# EAGLE design interstage_A2v2 (EAGLE 9.1.0)
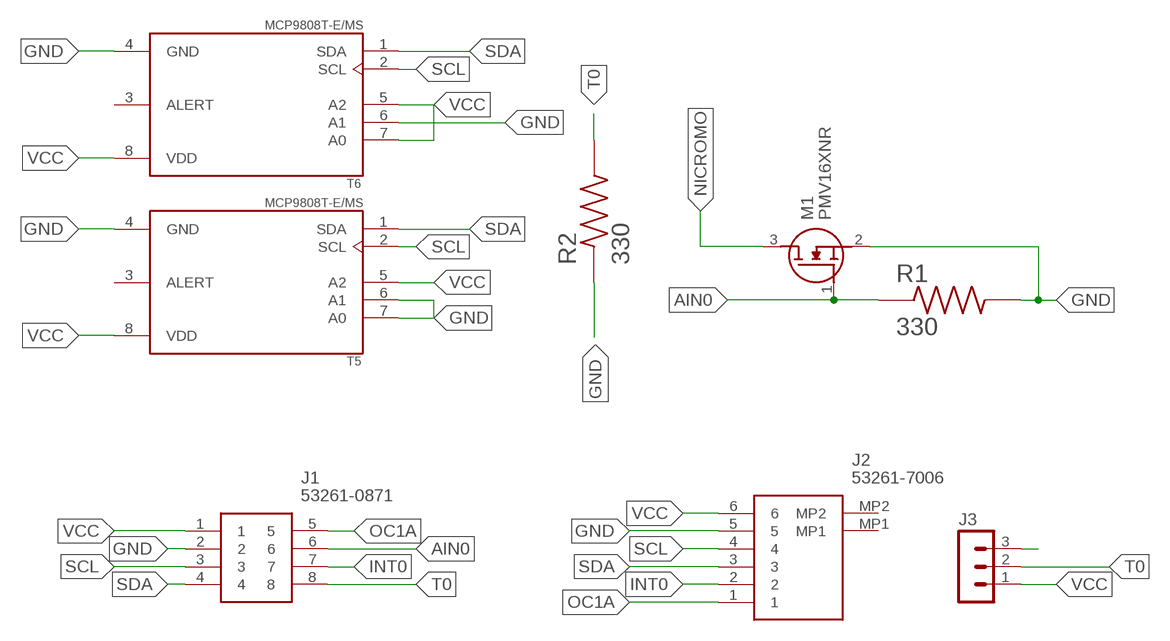
[diagram p0: schematic, sheet 1]

## Parts
J1  53261-0871  [53261-0871]
J2  53261-7006  [532617006]
J3  MA03-1  [MA03-1]
M1  PMV16XNR  [SOT95P230X110-3N]
R1  330  ERA-8AEB331V  [RESC3216X70N]
R2  330  ERA-8AEB331V  [RESC3216X70N]
T5  MCP9808T-E/MS  [SOP65P490X110-8N]
T6  MCP9808T-E/MS  [SOP65P490X110-8N]

## Nets
AIN0: J1.6 M1.1(G) R1.1
GND: J1.2 J2.5 M1.2(S) R1.2 R2.1 T5.4(GND) T5.6(A1) T5.7(A0) T6.4(GND) T6.6(A1)
INT0: J1.7 J2.2
N$7: J3.3
NICROMO: M1.3(D)
OC1A: J1.5 J2.1
SCL: J1.3 J2.4 T5.2(SCL) T6.2(SCL)
SDA: J1.4 J2.3 T5.1(SDA) T6.1(SDA)
T0: J1.8 J3.2 R2.2
VCC: J1.1 J2.6 J3.1 T5.5(A2) T5.8(VDD) T6.5(A2) T6.7(A0) T6.8(VDD)
Unconnected: J2.MP1 J2.MP2 T5.3(ALERT) T6.3(ALERT)

## Library data of the parts
J1 = SamacSys_Parts:53261-0871: Molex PICOBLADE Series, Series Number 53261, 1.25mm Pitch, 8 Way 1 Row Shrouded Right Angle PCB Header, Surface Mount Source: Datasheet <http://www.molex.com/webdocs/datasheets/pdf/en-us/0532610871_PCB_HEADERS.pdf>; DESCRIPTION: Molex PICOBLADE Series, Series Number 53261, 1.25mm Pitch, 8 Way 1 Row Shrouded Right Angle PCB Header, Surface Mount; HEIGHT: mm; MANUFACTURER_NAME: Molex; MANUFACTURER_PART_NUMBER: 53261-0871; MOUSER_PART_NUMBER: 538-53261-0871; MOUSER_PRICE-STOCK: https://www.mouser.co.uk/ProductDetail/Molex/53261-0871?qs=%252B72YyncTwW%252BggfdCJ7Netw%3D%3D
J2 = SamacSys_Parts:53261-7006: 1.25mm Pitch, PicoBlade PCB Header, Single Row, Right-Angle, Surface Mount, Gold (Au) Plating, Friction Lock, Circuits, Tape and Reel Source: Datasheet <https://componentsearchengine.com/Datasheets/1/53261-7006.pdf>; DESCRIPTION: 1.25mm Pitch, PicoBlade PCB Header, Single Row, Right-Angle, Surface Mount, Gold (Au) Plating, Friction Lock, Circuits, Tape and Reel; HEIGHT: 3.6mm; MANUFACTURER_NAME: Molex; MANUFACTURER_PART_NUMBER: 53261-7006; MOUSER_PART_NUMBER: 538-53261-7006; MOUSER_PRICE-STOCK: https://www.mouser.co.uk/ProductDetail/Molex/53261-7006?qs=0lSvoLzn4L%2FSBef0BTU2GA%3D%3D
J3 = con-lstb:MA03-1: PIN HEADER; OC_FARNELL: unknown; OC_NEWARK: unknown
M1 = SamacSys_Parts:PMV16XNR: Nexperia PMV16XNR N-channel MOSFET, 8.6 A, 20 V PMV16XN, 3-Pin SOT-23 Source: Datasheet <https://componentsearchengine.com/Datasheets/1/PMV16XNR.pdf>; DESCRIPTION: Nexperia PMV16XNR N-channel MOSFET, 8.6 A, 20 V PMV16XN, 3-Pin SOT-23; HEIGHT: 1.1mm; MANUFACTURER_NAME: Nexperia; MANUFACTURER_PART_NUMBER: PMV16XNR; MOUSER_PART_NUMBER: 771-PMV16XNR; MOUSER_PRICE-STOCK: https://www.mouser.com/Search/Refine.aspx?Keyword=771-PMV16XNR
R1 R2 = resistor_330_smd:ERA-8AEB331V; DESCRIPTION: 330 Ohms ±0.1% 0.25W, 1/4W Chip Resistor 1206 (3216 Metric) Automotive AEC-Q200 Thin Film; DIGI-KEY_PART_NUMBER: P330BCCT-ND; MF: Panasonic Electronic; MP: ERA-8AEB331V; PACKAGE: 3216 Panasonic Electronic Components
T5 T6 = sensorSPEL:MCP9808T-E/MS: Board Mount Temperature Sensors Silicon temp sensor with I2C interface; DESCRIPTION: Temperature Sensor Digital, Local -40°C ~ 125°C 10 b 8-MSOP; DIGI-KEY_PART_NUMBER: MCP9808T-E/MSCT-ND; MF: Microchip; MP: MCP9808T-E/MS; PACKAGE: MSOP-8 Microchip

## Board
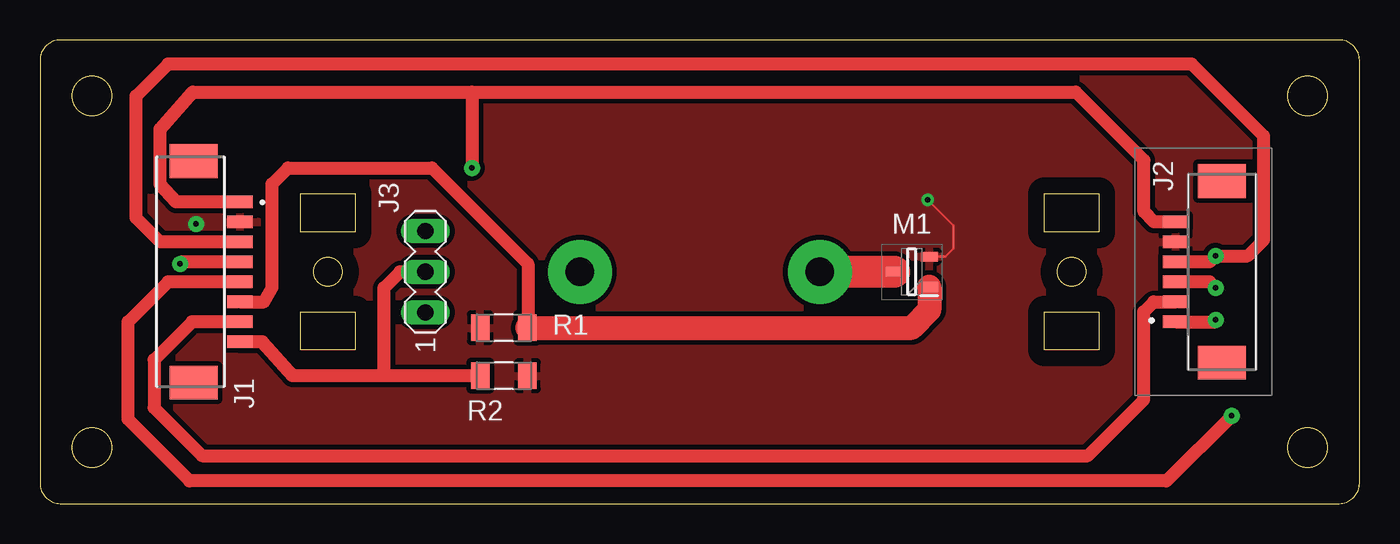
[diagram p1: board, top side]
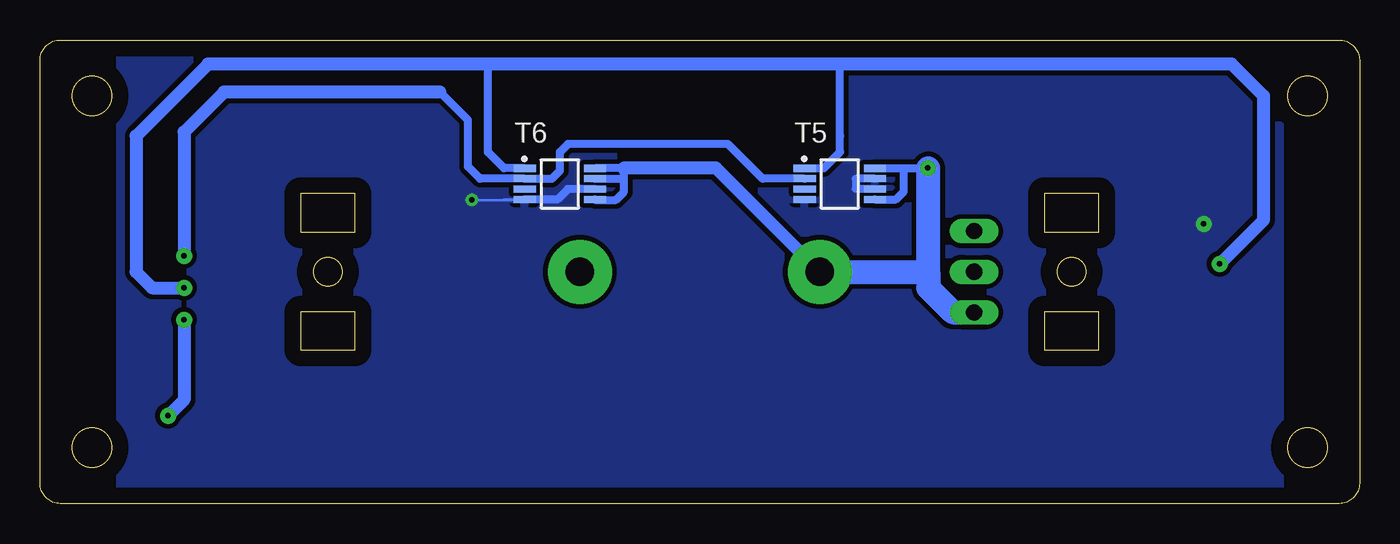
[diagram p2: board, bottom side, seen from below]

Size 82.5 x 29 mm. Coordinates in mm from the lower left corner, seen from the top.
Outline: 16.3,17 16.3,19.4 19.7,19.4 19.7,17 16.3,17
Outline: 62.8,9.6 62.8,12 66.2,12 66.2,9.6 62.8,9.6
Outline: 16.3,9.6 16.3,12 19.7,12 19.7,9.6 16.3,9.6
Outline: 62.8,17 62.8,19.4 66.2,19.4 66.2,17 62.8,17
Outline: 82.5,1.27 82.5,27.73 arc90 81.23,29 1.27,29 arc90 0,27.73 0,1.27 arc90 1.27,0 81.23,0 arc90 82.5,1.27
Outline: circle at 18,14.5 radius 0.9
Outline: circle at 64.5,14.5 radius 0.9
Outline: circle at 3.25,25.5 radius 1.25
Outline: circle at 79.25,3.5 radius 1.25
Outline: circle at 79.25,25.5 radius 1.25
Outline: circle at 3.25,3.5 radius 1.25
Copper layers (1*16): Top 0.035mm / dielectric 1.5mm / Bottom 0.035mm
Design rules "default *": minimum track width 6mil, minimum drill 0.35mm, track to track 0.3mm, track to pad 6mil, pad to pad 6mil, via to via 6mil, smd to smd 6mil, copper to edge 40mil, drill to drill 6mil, minimum pad ring 10mil, minimum via ring 8mil, stop-mask expansion 4mil, vias tented up to drill 0mil, thermal gap 10mil

### Footprints (pad centres in the part's own frame; a part is rotated, then mirrored left to right if it is on the bottom)
53261-0871 = smd 0.8 x 1.6: 1 -4.375,1.004; 2 -3.125,1.004; 3 -1.875,1.004; 4 -0.625,1.004; 5 0.625,1.004; 6 1.875,1.004; 7 3.125,1.004; 8 4.375,1.004 | smd 2.1 x 3: 9 6.925,-1.896; 10 -6.925,-1.896
532617006 = smd 0.8 x 1.6: 1 3.125,-2.5; 2 1.875,-2.5; 3 0.625,-2.5; 4 -0.625,-2.5; 5 -1.875,-2.5; 6 -3.125,-2.5 | smd 2.1 x 3: MP1 5.675,0.4; MP2 -5.675,0.4
MA03-1 = drill 1.016 long: 1 -2.54,0; 2 0,0; 3 2.54,0
SOT95P230X110-3N = smd 1.05 x 0.6: 1 -1.1,0.95; 2 -1.1,-0.95; 3 1.1,0
RESC3216X70N = smd 1.16 x 1.68: 1 -1.475,0; 2 1.475,0
SOP65P490X110-8N = smd 1.4 x 0.45: 1 -2.2,0.975; 2 -2.2,0.325; 3 -2.2,-0.325; 4 -2.2,-0.975; 5 2.2,-0.975; 6 2.2,-0.325; 7 2.2,0.325; 8 2.2,0.975

### Placement (x,y rotation side)
J1  11.5,14.5 270 top
J2  73.5,14.5 270 top
J3  24.1,14.5 90 top
M1  54.5,14.5 180 top
R1  29,11 180 top
R2  29,8 180 top
T5  32.5,20 0 bottom
T6  50,20 0 bottom

### Tracks (layer width: path | path; a pad name or v marks a point on that pad's centre or on a via)
AIN0
  Top 0.5: 30.5,11.03 R1.1
  Top 0.8: J1.6 14,12.62 14.5,13.5 14.5,20 15.5,21 24.5,21 30.5,15 30.5,11.03
  Top 1.5: R1.1 54.5,11 55.6,12.1 M1.1
GND  (via drill 0.35, 0.35 pad 1)
  Top 0.152: v55.5,19 57.1,17.4 57.1,15.95 56.6,15.45 M1.2
  Bottom 0.152: 53.5,19 53.48,19.02 T6.4 52.23,19 v55.5,19
  Bottom 0.5: T5.6 31.5,19.68 31.5,20.32 T5.7 | T6.6 49.5,19.68 50.15,19.02 T6.4
  other vias: 9.75,17.5
  pour Top (isolate 0.25): 5,28.3 5,0.5 77.5,0.5 77.5,28.3
  pour Bottom (isolate 0.25): 5,28.2 5,0.5 77.5,0.5 77.5,28.2
INT0
  Top 0.8: J1.7 9.5,11.38 7.12,9 7.12,6 10.12,3 65.5,3 69,6.5 69,12 69.62,12.62 J2.2
NICROMO  (via drill 1.8 pad 4)
  Top 2: M1.3 v48.75,14.5
OC1A  (via drill 0.35 pad 1)
  Top 0.8: J1.5 8,13.88 5.5,11.38 5.5,5.27 9.35,1.42 70.42,1.42 v74.5,5.5 | J2.1 73.5,11.38 v73.5,11.5
  Bottom 0.8: v73.5,11.5 73.5,6.5 v74.5,5.5
SCL  (via drill 0.35 pad 1)
  Top 0.8: J1.3 7.5,16.38 6,17.88 6,25.5 8,27.5 72,27.5 76.5,23 76.5,16.5 75.5,15.5 v73.5,15.5 73.12,15.12 J2.4
  Bottom 0.5: T5.2 37.33,20.32 39.5,22.5 49.5,22.5 50,22 50,20.82 50.5,20.32 T6.2 55,20.32 55.75,21.07 55.75,24 57.5,25.75
  Bottom 0.8: 57.5,25.75 71,25.75 73.5,23.25 v73.5,15.5
SDA  (via drill 0.35 pad 1)
  Top 0.5: 8.88,15.12 v8.75,15
  Top 0.8: J1.4 8.88,15.12 | v73.5,13.5 73.12,13.88 J2.3
  Bottom 0.5: T6.1 53.5,20.98 54.5,21.98 54.5,27.5 | T5.1 33.5,20.98 32.48,22 32.48,23 32.5,23.02 32.5,27.5
  Bottom 0.8: v8.75,15 6,17.75 6,25.5 8,27.5 32.5,27.5 54.5,27.5 72,27.5 76.5,23 76.5,14.5 75.5,13.5 v73.5,13.5
T0
  Top 0.8: J3.2 22.5,14.5 21.5,13.5 21.5,8.25 21.67,8 | R2.2 21.67,8 | J1.8 13.9,10.12 15.78,8 21.67,8
VCC  (via drill 0.35 pad 1, 1.8 pad 4)
  Top 0.8: 27,25.75 v27,21 | 27,25.75 9.56,25.75 7.5,23.44 7.5,19.96 8.5,18.88 J1.1 | 27,25.75 64.75,25.75 69.02,21.48 69.02,18.26 69.65,17.62 J2.6
  Bottom 0.5: T5.8 28.5,20.98 | T6.8 46,20.98 46,20.5 | v27,21 26.48,21 26.46,20.98 26.96,20.98 28.5,20.98 | T5.5 29,19.02 28.5,19.52 28.5,20.98 | T6.5 47.77,19 46.5,19 46,19.5 46,20.5 | T6.7 46.17,20.32 46,20.5
  Bottom 0.8: v33.75,14.5 40.25,21 45.98,21 46,20.98
  Bottom 1.5: v33.75,14.5 26.96,14.5 | 26.96,14.5 26.96,13.5 25.42,11.96 J3.1 | 26.96,14.5 26.96,20.98